# EAGLE design executingModuleTriac (EAGLE 5.07)
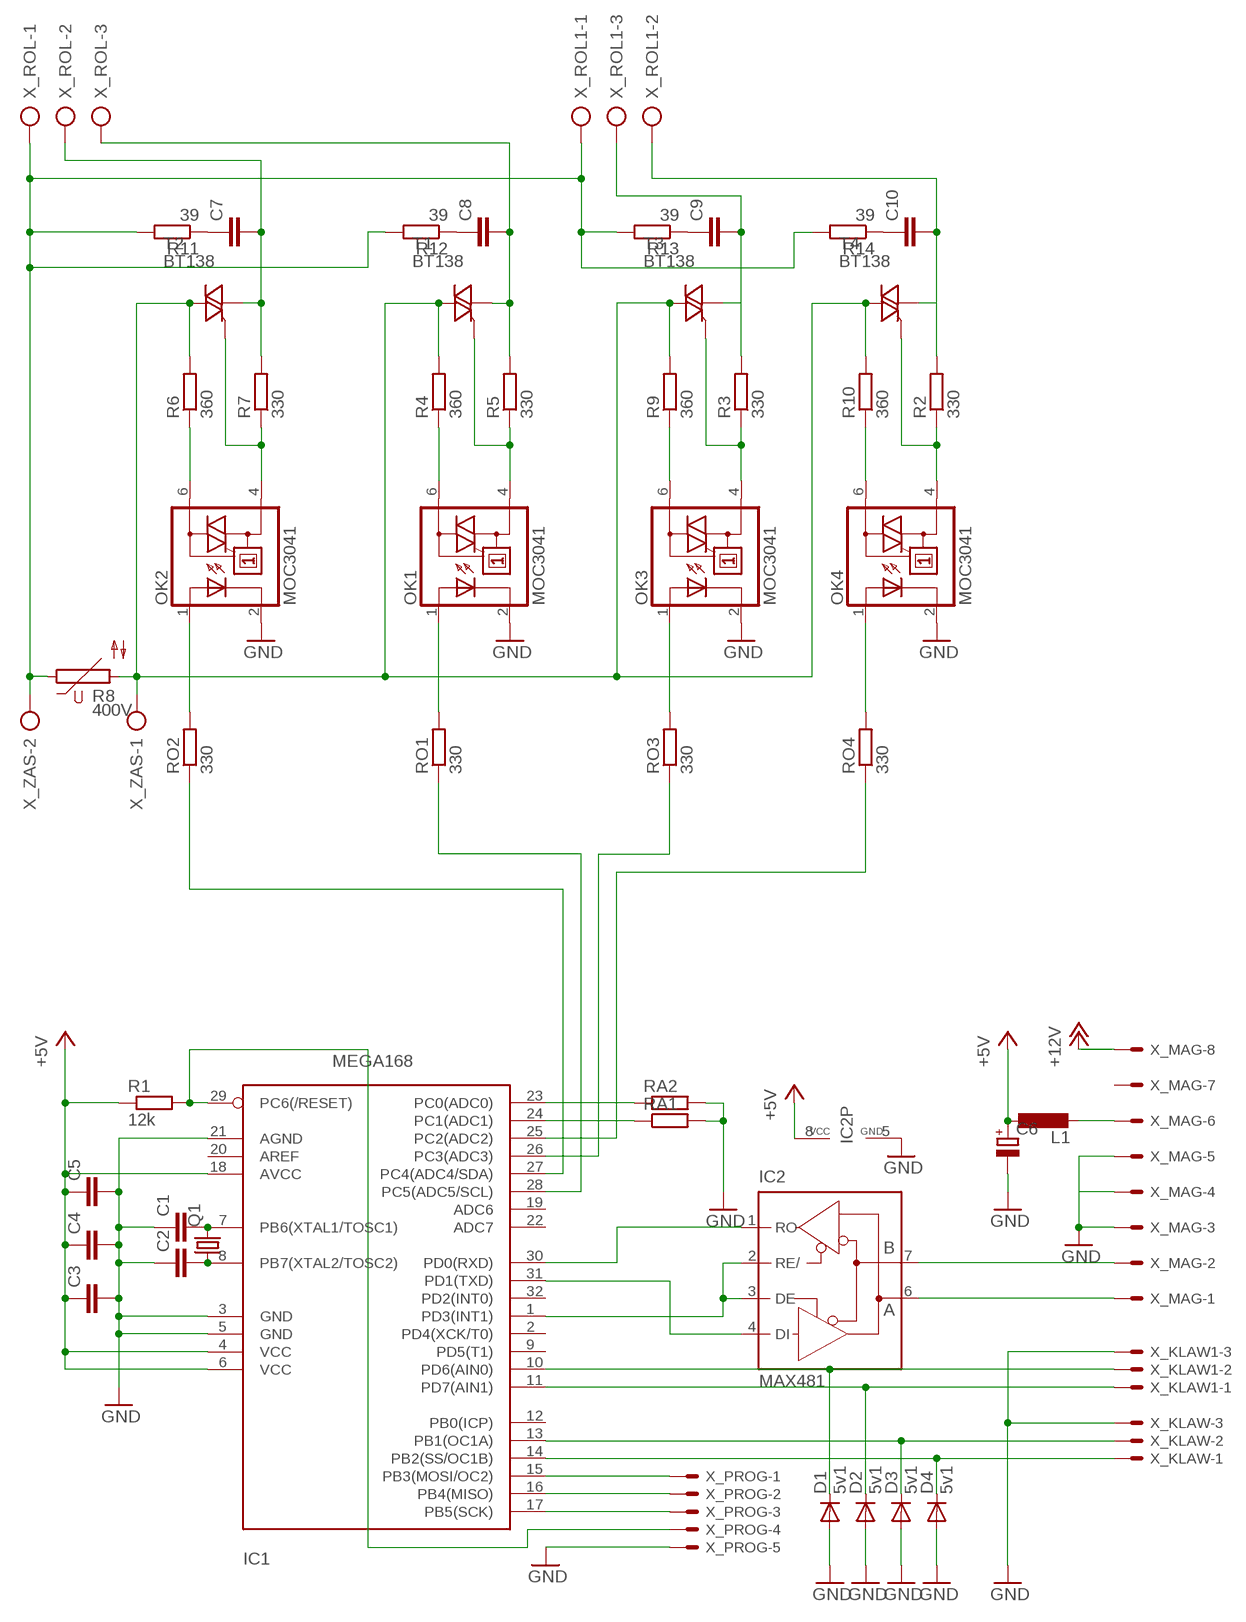
[diagram p0: schematic, sheet 1]

## Parts
C1  C-EUC0805  [C0805]
C2  C-EUC0805  [C0805]
C3  C-EUC0805  [C0805]
C4  C-EUC0805  [C0805]
C5  C-EUC0805  [C0805]
C6  CPOL-EUE2.5-6  [E2,5-6]
C7  C-EU050-025X075  [C050-025X075]
C8  C-EU050-025X075  [C050-025X075]
C9  C-EU050-025X075  [C050-025X075]
C10  C-EU050-025X075  [C050-025X075]
D1  5v1  CGRM4001-G  [SOD-123_MINI-SMA]
D2  5v1  CGRM4001-G  [SOD-123_MINI-SMA]
D3  5v1  CGRM4001-G  [SOD-123_MINI-SMA]
D4  5v1  CGRM4001-G  [SOD-123_MINI-SMA]
IC1  MEGA168  MEGA8-AI  [TQFP32-08]
IC2  MAX481  MAX481CSA  [SO08]
L1  L-EUL1812  [L1812]
OK1  MOC3041  MOC3041M  [DIL06]
OK2  MOC3041  MOC3041M  [DIL06]
OK3  MOC3041  MOC3041M  [DIL06]
OK4  MOC3041  MOC3041M  [DIL06]
Q1  CRYTALHC49S  [HC49/S]
R1  12k  R-EU_R0805  [R0805]
R2  330  R-EU_0207/2V  [0207/2V]
R3  330  R-EU_0207/2V  [0207/2V]
R4  360  R-EU_0207/2V  [0207/2V]
R5  330  R-EU_0207/2V  [0207/2V]
R6  360  R-EU_0207/2V  [0207/2V]
R7  330  R-EU_0207/2V  [0207/2V]
R8  400V  P593  [P593]
R9  360  R-EU_0207/2V  [0207/2V]
R10  360  R-EU_0207/2V  [0207/2V]
R11  39  R-EU_0207/2V  [0207/2V]
R12  39  R-EU_0207/2V  [0207/2V]
R13  39  R-EU_0207/2V  [0207/2V]
R14  39  R-EU_0207/2V  [0207/2V]
RA1  R-EU_R0805  [R0805]
RA2  R-EU_R0805  [R0805]
RO1  330  R-EU_R0805  [R0805]
RO2  330  R-EU_R0805  [R0805]
RO3  330  R-EU_R0805  [R0805]
RO4  330  R-EU_R0805  [R0805]
T1  BT138  [TO126S]
T2  BT138  [TO126S]
T3  BT138  [TO126S]
T4  BT138  [TO126S]
X_KLAW  22-23-2031  [22-23-2031]
X_KLAW1  22-23-2031  [22-23-2031]
X_MAG  22-23-2081  [22-23-2081]
X_PROG  22-23-2051  [22-23-2051]
X_ROL  COM  AK500/3-H  [AK500/3-H]
X_ROL1  COM  AK500/3-H  [AK500/3-H]
X_ZAS  AK300/2  [AK300/2]

## Nets
+5V: C3.1 C4.1 C5.1 C6.+ IC1.4(VCC) IC1.6(VCC) IC1.18(AVCC) IC2.8(VCC) L1.1 R1.1
+12V: X_MAG.8
ADDR0: IC1.23(PC0(ADC0)) RA2.1
ADDR1: IC1.24(PC1(ADC1)) RA1.1
ADDR2: IC1.15(PB3(MOSI/OC2)) X_PROG.1
ADDR3: IC1.16(PB4(MISO)) X_PROG.2
ADDR4: IC1.17(PB5(SCK)) X_PROG.3
COM: R8.1 R11.2 R12.2 R13.2 R14.2 X_ROL1.1 X_ROL.1 X_ZAS.2
F_ROL1: C7.2 R7.2 T2.C(A1) X_ROL.2
F_ROL2: C8.2 R5.2 T1.C(A1) X_ROL.3
F_ROL3: C9.2 R3.2 T3.C(A1) X_ROL1.3
F_ROL4: C10.2 R2.2 T4.C(A1) X_ROL1.2
FAZA: R4.2 R6.2 R8.2 R9.2 R10.2 T1.A(A2) T2.A(A2) T3.A(A2) T4.A(A2) X_ZAS.1
GND: C1.1 C2.1 C3.2 C4.2 C5.2 C6.- D1.A D2.A D3.A D4.A IC1.3(GND) IC1.5(GND) IC1.21(AGND) IC2.5(GND) OK1.2(C) OK2.2(C) OK3.2(C) OK4.2(C) RA1.2 RA2.2 X_KLAW1.3 X_KLAW.3 X_MAG.3 X_MAG.4 X_MAG.5 X_PROG.5
KL1: D4.C IC1.14(PB2(SS/OC1B)) X_KLAW.1
KL2: D3.C IC1.13(PB1(OC1A)) X_KLAW.2
N$1: OK2.6(A2) R6.1
N$2: L1.2 X_MAG.6
N$3: OK2.4(A1) R7.1 T2.G
N$4: IC2.7(B) X_MAG.2
N$5: IC2.6(A) X_MAG.1
N$7: OK3.4(A1) R3.1 T3.G
N$8: OK3.6(A2) R9.1
N$9: OK4.6(A2) R10.1
N$10: OK4.4(A1) R2.1 T4.G
N$12: C1.2 IC1.7(PB6(XTAL1/TOSC1)) Q1.2
N$13: C2.2 IC1.8(PB7(XTAL2/TOSC2)) Q1.1
N$17: C7.1 R11.1
N$18: D2.C IC1.11(PD7(AIN1)) X_KLAW1.1
N$19: D1.C IC1.10(PD6(AIN0)) X_KLAW1.2
N$20: C8.1 R12.1
N$22: C9.1 R13.1
N$23: C10.1 R14.1
N$24: OK1.6(A2) R4.1
N$25: OK1.4(A1) R5.1 T1.G
ROL1_ON: IC1.27(PC4(ADC4/SDA)) RO2.1
ROL1_ON_R: OK2.1(A) RO2.2
ROL2_ON: IC1.28(PC5(ADC5/SCL)) RO1.1
ROL2_ON_R: OK1.1(A) RO1.2
ROL3_ON: IC1.26(PC3(ADC3)) RO3.1
ROL3_ON_R: OK3.1(A) RO3.2
ROL4_ON: IC1.25(PC2(ADC2)) RO4.1
ROL4_ON_R: OK4.1(A) RO4.2
RST: IC1.29(PC6(/RESET)) R1.2 X_PROG.4
RXD: IC1.30(PD0(RXD)) IC2.1(RO)
TXD: IC1.31(PD1(TXD)) IC2.4(DI)
TXD_RXD_EN: IC1.1(PD3(INT1)) IC2.2(RE/) IC2.3(DE)
Unconnected: IC1.2(PD4(XCK/T0)) IC1.9(PD5(T1)) IC1.12(PB0(ICP)) IC1.19(ADC6) IC1.20(AREF) IC1.22(ADC7) IC1.32(PD2(INT0)) X_MAG.7

## Library data of the parts
C1-C5 C7-C10 = rcl:C-EU: CAPACITOR, European symbol
C6 = rcl:CPOL-EU: POLARIZED CAPACITOR, European symbol
D1-D4 = diode:CGRM400*-G: Molded plasitc,JEDEC SOD-123/Mini SMA Source: Comchip CGRM4001-G.pdf
IC1 = atmel:MEGA8: MICROCONTROLLER 8 Kbytes FLASH 1 kbytes SRAM 512 bytes EEPROM USART 6-channel 10 bit ADC 2-channel 8 bit ADC Source: avr.lbr
IC2 = maxim:MAX481CSA: RS485 TRANSEIVER
L1 = rcl:L-EU: INDUCTOR, European symbol
OK1-OK4 = optocoupler:MOC30*: 6-Pin DIP Zero-Cross Optoisolators Triac Driver Output (250/400 Volt Peak) Source: http://www.fairchildsemi.com/ds/MO/MOC3043-M.pdf
Q1 = crystal:CRYTAL: CRYSTAL
R1-R7 R9-R14 RA1 RA2 RO1-RO4 = rcl:R-EU_: RESISTOR, European symbol
R8 = varistor:P593: VARISTOR
T1-T4 = triac:BT138: TRIAC Source: http://www.semiconductors.philips.com BT138_SERIES_2.pdf
X_KLAW X_KLAW1 = con-molex:22-23-2031: .100" (2.54mm) Center Header - 3 Pin
X_MAG = con-molex:22-23-2081: .100" (2.54mm) Center Header - 8 Pin
X_PROG = con-molex:22-23-2051: .100" (2.54mm) Center Header - 5 Pin
X_ROL X_ROL1 = con-ptr500:AK500/3-H: CONNECTOR Aug. 2004 / PTR Meßtechnik: Die Bezeichnung der Serie AK505 wurde geändert. Es handelt sich hierbei um AK500 in horizontaler Ausführung.
X_ZAS = con-ptr500:AK300/2: CONNECTOR

## Board
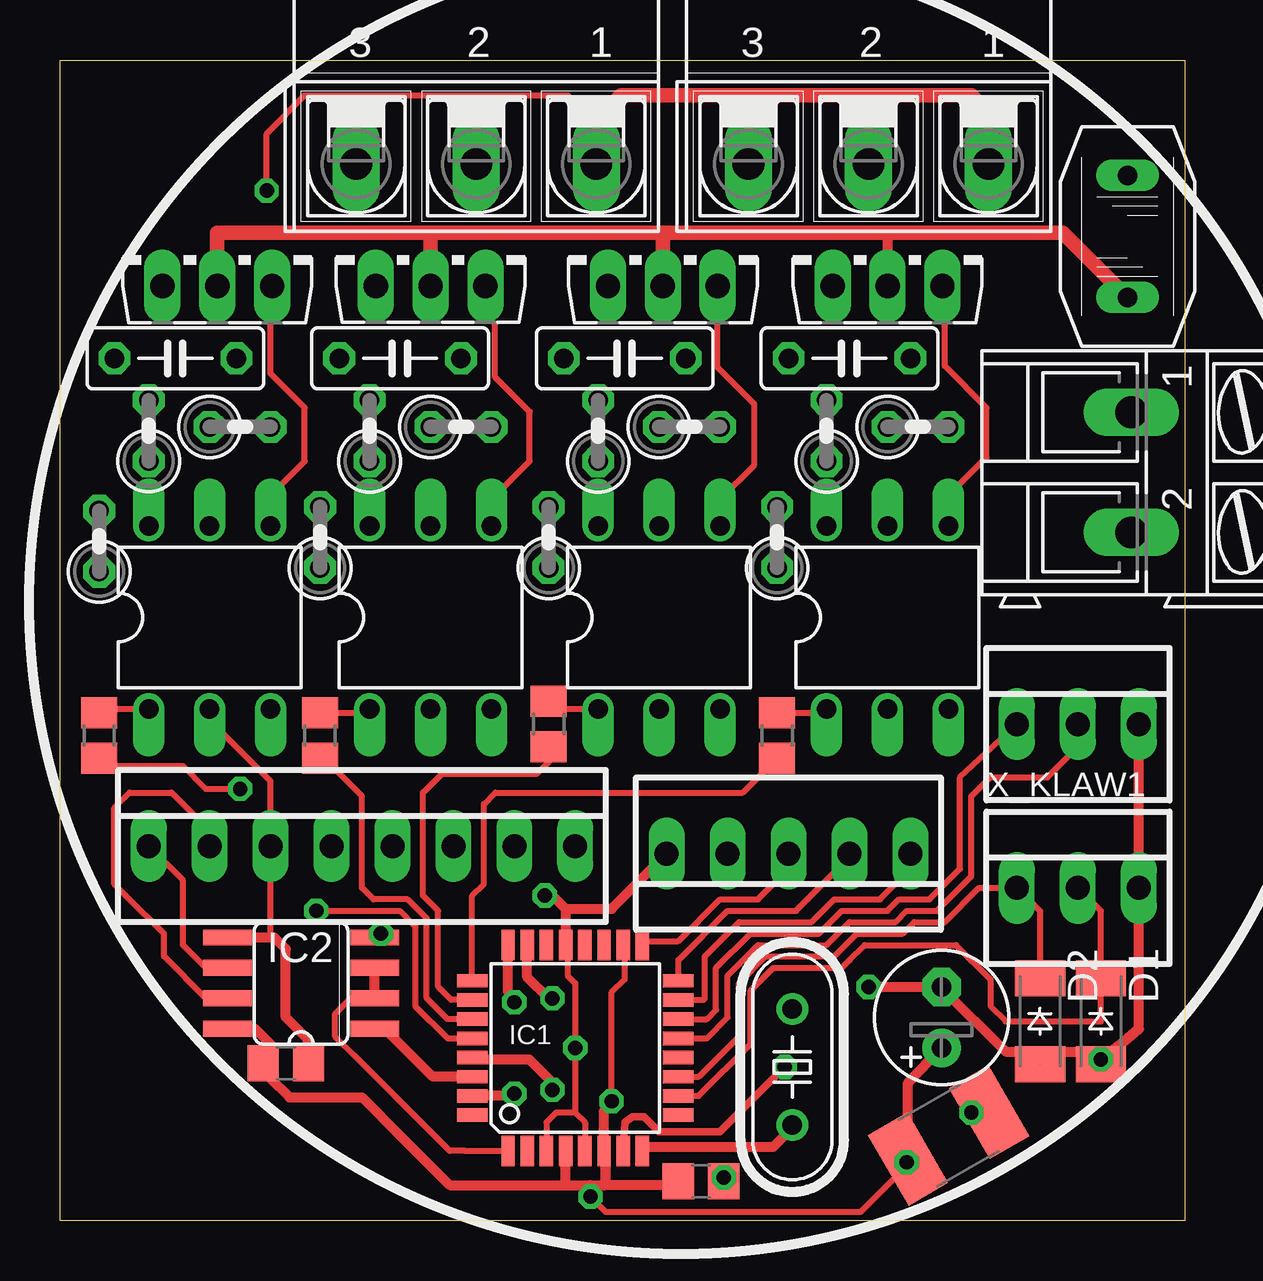
[diagram p1: board, top side]
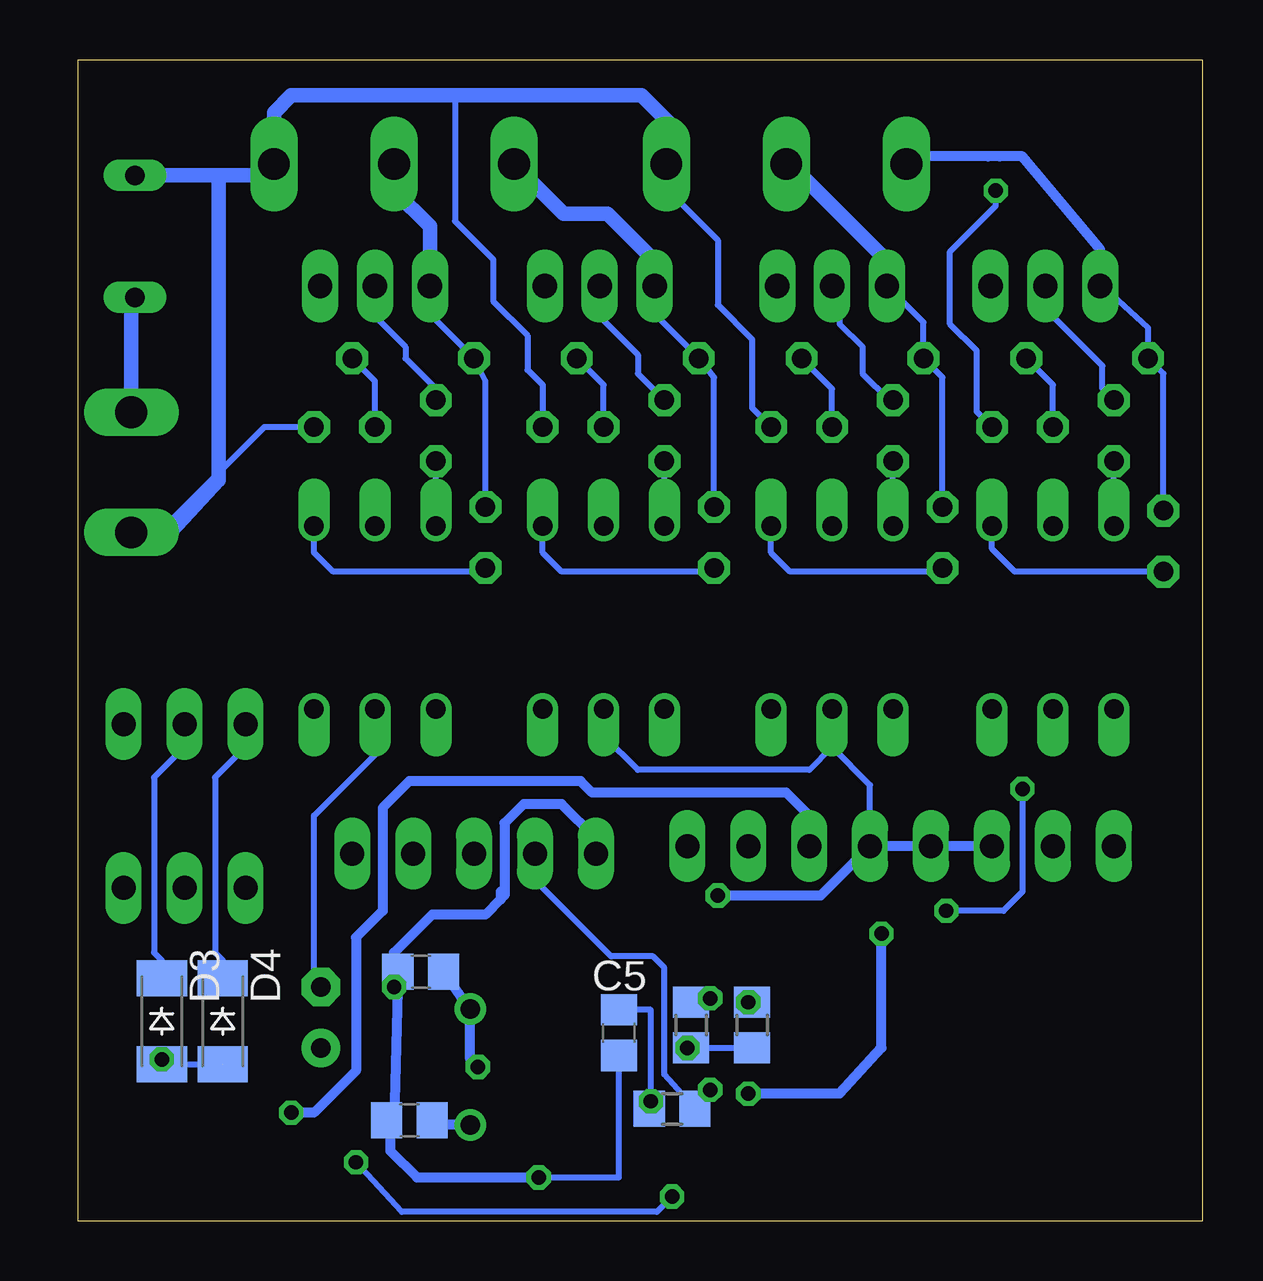
[diagram p2: board, bottom side, seen from below]

Size 46.88 x 48.36 mm. Coordinates in mm from the lower left corner, seen from the top.
Outline: 0,48.35 46.88,48.35 46.88,0 0,0 0,48.35
Copper layers (1*16): Top 0.035mm / dielectric 1.5mm / Bottom 0.035mm
Design rules "default *": minimum track width 10mil, minimum drill 20mil, track to track 8mil, track to pad 8mil, pad to pad 8mil, via to via 8mil, smd to smd 8mil, copper to edge 5mil, drill to drill 8mil, minimum pad ring 10mil, minimum via ring 8mil, stop-mask expansion 4mil, vias tented up to drill 0mil, thermal gap 10mil

### Footprints (pad centres in the part's own frame; a part is rotated, then mirrored left to right if it is on the bottom)
C0805 = smd 1.3 x 1.5: 1 -0.95,0; 2 0.95,0
E2,5-6 = drill 0.813 pad 1.6 round: + -1.27,0 | drill 0.813 pad 1.6 octagon: - 1.27,0
C050-025X075 = drill 0.813 octagon: 1 -2.54,0; 2 2.54,0
SOD-123_MINI-SMA = smd 1.5 x 2.1: A 1.8,0; C -1.8,0
TQFP32-08 = smd 1.27 x 0.559: 1 -4.293,2.8; 2 -4.293,2; 3 -4.293,1.2; 4 -4.293,0.4; 5 -4.293,-0.4; 6 -4.293,-1.2; 7 -4.293,-2; 8 -4.293,-2.8; 17 4.293,-2.8; 18 4.293,-2; 19 4.293,-1.2; 20 4.293,-0.4; 21 4.293,0.4; 22 4.293,1.2; 23 4.293,2; 24 4.293,2.8 | smd 0.559 x 1.27: 9 -2.8,-4.293; 10 -2,-4.293; 11 -1.2,-4.293; 12 -0.4,-4.293; 13 0.4,-4.293; 14 1.2,-4.293; 15 2,-4.293; 16 2.8,-4.293; 25 2.8,4.293; 26 2,4.293; 27 1.2,4.293; 28 0.4,4.293; 29 -0.4,4.293; 30 -1.2,4.293; 31 -2,4.293; 32 -2.8,4.293
SO08 = smd 0.66 x 2.032: 1 -1.905,-3.073; 2 -0.635,-3.073; 3 0.635,-3.073; 4 1.905,-3.073; 5 1.905,3.073; 6 0.635,3.073; 7 -0.635,3.073; 8 -1.905,3.073
L1812 = smd 1.9 x 3.4: 1 -1.95,0; 2 1.95,0
DIL06 = drill 0.813 offset: 1 -2.54,-3.81; 2 0,-3.81; 3 2.54,-3.81; 4 2.54,3.81; 5 0,3.81; 6 -2.54,3.81
HC49/S = drill 0.813 round: 1 -2.413,0; 2 2.413,0
R0805 = smd 1.3 x 1.5: 1 -0.95,0; 2 0.95,0
0207/2V = drill 0.813 octagon: 1 -1.27,0; 2 1.27,0
P593 = drill 0.813 long: 1 0,2.54; 2 0,-2.54
TO126S = drill 1.016 long: A 0,-1.27; C -2.286,-1.27; G 2.286,-1.27
22-23-2031 = drill 1 long: 1 -2.54,0; 2 0,0; 3 2.54,0
22-23-2081 = drill 1 long: 1 -8.89,0; 2 -6.35,0; 3 -3.81,0; 4 -1.27,0; 5 1.27,0; 6 3.81,0; 7 6.35,0; 8 8.89,0
22-23-2051 = drill 1 long: 1 -5.08,0; 2 -2.54,0; 3 0,0; 4 2.54,0; 5 5.08,0
AK500/3-H = drill 1.321 long: 1 -5.004,0; 2 0,0; 3 5.004,0
AK300/2 = drill 1.321 long: 1 -2.515,0; 2 2.489,0

### Placement (x,y rotation side)
C1  32.59,10.37 0 bottom
C2  33.07,4.17 0 bottom
C3  9.41,6.56 0 top
C4  26.72,1.64 0 top
C5  24.34,7.83 270 bottom
C6  36.75,8.46 90 top
C7  14.18,35.92 180 top
C8  4.81,35.92 180 top
C9  23.54,35.92 180 top
C10  32.91,35.92 180 top
D1  43.39,8.3 270 top
D2  40.85,8.3 270 top
D3  43.39,8.3 270 bottom
D4  40.85,8.3 270 bottom
IC1  21.48,7.19 90 top
IC2  10.05,9.89 90 top
L1  37.04,3.54 30 top
OK1  6.24,25.13 0 top
OK2  15.45,25.13 0 top
OK3  24.97,25.13 0 top
OK4  34.5,25.13 0 top
Q1  30.53,6.4 90 top
R1  22.11,4.65 0 bottom
R2  29.89,28.46 90 top
R3  20.37,28.46 90 top
R4  3.7,32.91 90 top
R5  1.63,28.31 90 top
R6  12.91,32.91 90 top
R7  10.84,28.46 90 top
R8  44.5,41.01 0 top
R9  22.43,32.91 90 top
R10  31.96,32.91 90 top
R11  16.72,33.07 0 top
R12  7.51,33.07 0 top
R13  26.24,33.07 0 top
R14  35.77,33.07 0 top
RA1  18.78,8.14 270 bottom
RA2  21.32,8.14 270 bottom
RO1  1.64,20.21 90 top
RO2  10.84,20.21 90 top
RO3  20.37,20.68 90 top
RO4  29.89,20.21 90 top
T1  6.56,40.21 0 top
T2  15.45,40.21 0 top
T3  25.13,40.21 0 top
T4  34.5,40.21 0 top
X_KLAW  42.43,20.68 0 top
X_KLAW1  42.43,13.86 0 top
X_MAG  12.59,15.61 0 top
X_PROG  30.37,15.29 180 top
X_ROL  17.35,44.02 180 top
X_ROL1  33.7,44.02 180 top
X_ZAS  44.66,31.16 270 top

### Tracks (layer width: path | path; a pad name or v marks a point on that pad's centre or on a via)
+5V  (via drill 0.6)
  Top 0.254: v23,4.97 23,9.5 23.54,10.05 23.54,11.42 IC1.18 | 25.45,1.48 22.11,1.48 v22.11,1 22.75,0.36 33.39,0.36 35.59,2.56 | 35.59,2.56 L1.1 | v35.29,2.43 35.59,2.56
  Top 0.406: C3.1 8.72,6.56 | 8.72,6.56 8.78,6.56 8.78,7.35 8.14,7.98 IC2.8 | 8.72,6.56 8.72,5.98 9.57,5.13 12.59,5.13 14.18,3.54 16.24,1.48 21,1.48 | 21,1.48 22.11,1.48 22.75,1.48 22.75,2.27 | 22.75,2.27 22.75,2.35 IC1.6 22.68,4.58 22.91,4.81 v23,4.97 | IC1.4 21.08,1.56 21,1.48 | C4.1 25.45,1.48 25.29,1.48 22.75,1.48 22.75,2.27 | L1.1 35.35,5.73 C6.+
  Bottom 0.254: R1.1 23,4.65 v23,4.97 23,8.78 C5.1 | v22.11,1 22.75,0.36 33.39,0.36 v35.29,2.43
ADDR0  (via drill 0.6)
  Top 0.406: IC1.23 19.48,10.14 20.37,9.25 v20.53,9.25
  Bottom 0.406: v20.53,9.25 20.53,9.41 20.21,9.41 RA2.1
ADDR1  (via drill 0.6)
  Top 0.406: IC1.24 18.68,9.51 v18.94,9.09
  Bottom 0.254: RA1.1 v18.94,9.09
ADDR2
  Top 0.254: IC1.15 26.81,9.19 26.88,9.25 26.88,11 28.31,12.43 31.32,12.43 32.27,13.38 34.18,13.38 35.45,14.65
  Top 0.305: 35.45,14.65 X_PROG.1
ADDR3
  Top 0.254: IC1.16 25.77,10.85 27.83,12.91 30.69,12.91 31.16,13.38 32.91,15.13
  Top 0.305: 32.91,15.13 X_PROG.2
ADDR4
  Top 0.254: 30.37,14.65 29.1,13.38 27.51,13.38 25.77,11.64 24.34,11.64 24.34,11.55 IC1.17
  Top 0.305: 30.37,14.65 X_PROG.3
COM  (via drill 0.6)
  Top 0.254: v8.62,42.91 8.62,45.29 10.21,46.88 21.16,46.88 22.27,45.77 | 22.27,44.18 22.27,44.1 X_ROL.1 | R12.2
  Top 0.61: 38.78,44.02 38.78,46.08 37.99,46.88 23.38,46.88 22.27,45.77 22.27,44.18
  Bottom 0.254: 22.27,45.77 22.27,44.1 X_ROL.1 22.27,43.94 22.27,42.91 20.21,40.85 20.21,38.15 18.78,36.72 18.78,33.86 R11.2 | R12.2 9.41,33.7 9.41,36.24 10.53,37.35 10.53,40.37 8.62,42.27 v8.62,42.91 | R14.2 39.1,33.07 43.55,28.62 44.66,28.62 44.82,28.78 42.99,28.7 | R13.2 27.51,34.81 28.15,35.45 28.15,36.88 29.58,38.31 29.58,40.05 31.16,41.64 31.16,46.88
  Bottom 0.406: 45.02,28.67 X_ZAS.2
  Bottom 0.61: 45.02,28.67 42.99,28.7 41.01,30.84 41.01,43.55 R8.1 39.18,43.54 X_ROL1.1 38.71,46.16 37.99,46.88 31.16,46.88 23.38,46.88 22.27,45.77
F_ROL1
  Bottom 0.254: T2.C 11.64,37.42 C7.2 10.84,35.13 R7.2 | 15.29,42.12
  Bottom 0.61: T2.C 13.16,39.99 15.29,42.12 16.72,43.54 16.88,43.54 X_ROL.2
F_ROL2
  Bottom 0.254: 4.27,39.04 2.27,37.19 C8.2 | R5.2 1.64,35.29 C8.2 | C8.2
  Bottom 0.406: T1.C 4.27,39.04 4.27,40.47 7.51,44.34 8.46,44.34 8.94,44.34 12.11,44.34 12.35,44.1 X_ROL.3
F_ROL3
  Bottom 0.254: R3.2 20.37,35.13 C9.2 | C9.2 | C9.2 22.75,37.67 22.75,38.85 T3.C
  Bottom 0.61: T3.C 22.84,39.99 24.81,41.96 26.64,41.96 X_ROL1.3
F_ROL4
  Bottom 0.254: R2.2 29.89,34.97 C10.2 | C10.2 | C10.2 32.27,37.83 32.27,38.88 T4.C
  Bottom 0.61: T4.C 32.21,41.42 33.7,42.91 X_ROL1.2
FAZA
  Top 0.254: 24.81,41.16 25.13,41.16 | 6.56,41.16 6.72,41.16 | 34.5,41.16
  Top 0.406: 34.5,41.16 T4.A
  Top 0.61: 15.45,41.16 T2.A | 6.72,41.16 15.45,41.16 | 15.45,41.16 24.81,41.16 34.5,41.16 41.8,41.16 R8.2 | 25.13,41.16 T3.A | T1.A 6.56,41.16
  Bottom 0.254: R4.2 4.18,34.65 4.18,35.61 6.56,37.99 T1.A | R6.2 13.07,34.18 14.18,35.29 14.18,36.4 15.13,37.35 15.13,38.62 T2.A | T1.A | R9.2 | R9.2 23.54,35.29 23.54,36.08 25.13,37.67 T3.A | T3.A | R10.2 31.96,34.65 33.23,35.92 33.23,36.4 34.5,37.67 T4.A | T4.A
  Bottom 0.406: R8.2 44.66,38.31
  Bottom 0.61: 44.66,38.31 X_ZAS.1
GND  (via drill 0.6)  (1 unrouted)
  Top 0.254: IC1.5 21.88,4.09 21.48,4.49 | IC1.3 20.28,4.09 20.69,4.49 21.48,4.49 | 21.48,4.49 | 21.48,4.49 v21.48,7.19 21.48,9.89 21.16,10.21 21.16,11.4 IC1.21 | 21.48,4.49 | 7.67,19.41 8.78,18.3 X_MAG.3 8.78,11.79 | 7.67,19.41 | 7.67,19.41 6.24,20.84 OK1.2 | 40.85,7.03 D4.A | D3.A | 43.39,7.03 D3.A | v43.39,6.71 43.96,7.19 44.52,7.59
  Top 0.406: 8.78,11.79 IC2.5 7.3,11.79 8.94,11.79 9.41,11.32 9.41,8.46 10.34,7.54 C3.2 | 21.08,12.99 IC1.21 | 21.08,12.99 20.53,13.54 v20.21,13.54 | 21.08,12.99 22.99,12.99 X_PROG.5 | v27.67,1.79 27.51,1.63 C4.2 | v33.7,9.73 C6.- 36.75,9.7 39.42,7.03 40.85,7.03 43.39,7.03 v43.39,6.71 44.52,7.59 44.97,7.98 X_KLAW1.3 X_KLAW.3 | X_KLAW.3
  Bottom 0.254: 24.34,5.92 24.34,1.79 v27.67,1.79 | 24.34,5.92 C5.2 | 24.34,5.92 | RA2.2 RA1.2 | RA2.2 | RA2.2 v21.48,7.19 | 15.45,19.73 OK2.2 | OK4.2 34.5,19.41 37.04,16.87 37.04,10.02 C6.- | D4.A D3.A 42.91,6.24 v43.39,6.71 | OK3.2 24.97,20.21 23.54,18.78 16.4,18.78 15.45,19.73 | X_MAG.5 13.86,18.14 15.45,19.73
  Bottom 0.406: v27.67,1.79 32.75,1.79 33.86,2.9 33.86,4.17 C2.1 33.7,4.17 C1.1 33.54,9.89 v33.7,9.73 33.7,10.37 33.7,11.16 32.12,12.75 29.89,12.75 29.26,13.38 29.26,13.7 29.1,13.54 29.1,16.56 28.31,17.35 26.72,17.35 25.29,15.92 X_PROG.5 | v20.21,13.54 15.92,13.54 X_MAG.5 X_MAG.4 X_MAG.3
KL1
  Top 0.254: IC1.14 26.97,8.39 27.35,8.78 27.35,10.52 28.78,11.95 31.64,11.95 31.96,12.27 | 31.96,12.27 | 31.96,12.27 32.59,12.91 34.5,12.91 34.97,13.38 36.24,13.38 37.51,14.65 37.51,18.46 39.74,20.53 X_KLAW.1
  Top 0.305: 39.74,20.53 39.26,20.05
  Bottom 0.254: D4.C 40.85,10.84 41.16,11.16 41.16,18.46 39.89,19.73 X_KLAW.1
KL2
  Top 0.254: IC1.13 26.96,7.59 27.83,8.46 27.83,10.21 29.1,11.48 31.96,11.48 32.91,12.43 34.81,12.43 35.29,12.91 36.56,12.91 37.99,14.33 37.99,17.67 38.78,18.46 41.16,18.46 42.43,19.73 X_KLAW.2 | X_KLAW.2
  Bottom 0.254: D3.C 43.39,10.84 43.7,11.16 43.7,18.46 42.43,19.73 X_KLAW.2 | X_KLAW.2
N$1
  Bottom 0.254: OK2.6 12.91,31.48
  Bottom 0.406: 12.91,31.48 R6.1
N$2  (via drill 0.6)
  Top 0.406: v37.99,4.49 38.7,4.49 L1.2
  Bottom 0.406: X_MAG.6 16.4,16.87 17.35,17.83 25.45,17.83 25.92,18.3 33.07,18.3 34.18,17.19 34.18,12.91 35.29,11.79 35.29,6.24 37.04,4.49 v37.99,4.49
N$3
  Top 0.254: OK2.4 17.99,30.05 19.57,31.64 19.57,33.7 18.15,35.13 18.15,37.35 17.67,37.83 17.67,38.88 T2.G
  Bottom 0.254: OK2.4 17.99,27.83 17.19,27.03 11,27.03 R7.1
N$4
  Top 0.254: IC2.7 6.08,9.25 4.33,11 4.33,11.95 2.75,13.54 2.27,14.02 2.27,17.19 2.91,17.83 4.65,17.83 6.24,16.24 X_MAG.2
N$5
  Top 0.254: IC2.6 6.08,10.52 5.13,11.48 5.13,14.18 X_MAG.1
N$7
  Top 0.254: T3.G 27.42,35.54 28.94,34.02 28.94,31.48 27.51,30.05 27.51,28.78 OK3.4
  Bottom 0.254: R3.1 20.53,27.03 26.72,27.03 27.51,27.83 27.51,28.78 OK3.4
N$8
  Bottom 0.254: OK3.6 R9.1 | R9.1
N$9
  Bottom 0.254: OK4.6 R10.1 | R10.1
N$10
  Top 0.254: OK4.4 37.04,30.21 38.62,31.8 38.62,33.86 36.88,35.61 36.88,38.85 T4.G
  Bottom 0.254: R2.1 30.05,27.03 36.24,27.03 37.04,27.83 OK4.4
N$12  (via drill 0.6)
  Top 0.305: IC1.7 23.54,4.1 23.86,4.33 24.34,4.33 24.97,3.7 27.51,3.7 v30.21,6.4
  Bottom 0.406: 30.53,6.71 Q1.2 30.56,8.81 C1.2 | 30.53,6.71 | v30.21,6.4 30.53,6.71
N$13
  Top 0.406: IC1.8 24.44,3.06 29.73,3.06 30.53,3.86 Q1.1
  Bottom 0.406: C2.2 32.09,3.98 Q1.1
N$17
  Bottom 0.254: R11.1 15.45,34.65 C7.1
N$18
  Top 0.254: IC1.11 26.63,5.99 28.31,7.67 28.31,9.89 29.42,11 32.27,11 33.23,11.95 35.13,11.95 35.61,12.43 36.88,12.43 38.31,13.86 X_KLAW1.1 40.85,12.91 D2.C
N$19
  Top 0.254: IC1.10 26.62,5.19 28.78,7.35 28.78,9.57 29.73,10.52 32.59,10.52 32.91,10.84 | 32.91,10.84 | 32.91,10.84 33.54,11.48 37.35,11.48 38.78,10.05 38.78,8.94 39.42,8.3 43.39,8.3 D1.C | D1.C 43.39,12.91 X_KLAW1.2 | D1.C
N$20
  Bottom 0.254: R12.1 6.24,34.81 C8.1
N$22
  Bottom 0.254: R13.1 24.97,34.81 C9.1
N$23
  Bottom 0.254: R14.1 34.5,34.97 C10.1
N$24
  Bottom 0.254: OK1.6 R4.1
  Bottom 0.406: R4.1
N$25
  Top 0.254: T1.G 8.78,38.88 8.78,35.29 10.21,33.86 10.21,31.64 8.78,30.21 OK1.4
  Bottom 0.254: R5.1 7.83,27.03 8.78,27.99 OK1.4
  Bottom 0.406: OK1.4
ROL1_ON
  Top 0.254: IC1.27 16.15,8.39 15.29,9.25 15.29,12.59 14.49,13.38 13.07,13.38 12.59,13.86 12.59,17.67 11,19.26 11,19.58 RO2.1
ROL1_ON_R
  Top 0.254: RO2.2 12.75,21.16 OK2.1
ROL2_ON  (via drill 0.6)
  Top 0.254: IC1.28 16.16,7.59 14.81,8.94 14.81,12.27 14.18,12.91 v10.68,12.91 | v7.51,17.99 6.08,17.99 5.13,18.94 1.96,18.94 RO1.1
  Bottom 0.254: v10.68,12.91 8.3,12.91 7.51,13.7 v7.51,17.99
ROL2_ON_R
  Top 0.254: OK1.1 | OK1.1 1.8,21.32 RO1.2
ROL3_ON
  Top 0.254: IC1.26 16.3,9.19 15.76,9.73 15.76,12.91 15.13,13.54 15.13,17.83 15.92,18.62 19.89,18.62 20.37,19.1 RO3.1 | RO3.1
ROL3_ON_R
  Top 0.254: OK3.1 20.68,21.32 RO3.2
ROL4_ON
  Top 0.254: IC1.25 17.19,13.53 17.67,14.02 17.67,17.35 18.15,17.83 28.46,17.83 RO4.1
ROL4_ON_R
  Top 0.254: RO4.2 31.8,21.16 OK4.1
RST  (via drill 0.6)
  Top 0.406: IC1.29 17.41,6.72 19.56,6.72 20.52,5.76 20.53,5.6 v20.53,5.44
  Bottom 0.254: X_PROG.4 27.83,14.18 24.65,11 22.91,11 22.43,10.52 22.43,6.08 R1.2
  Bottom 0.406: v20.53,5.44 R1.2
RXD
  Top 0.406: IC2.1 13.6,7.93 15.54,5.99 IC1.30
TXD  (via drill 0.6)
  Top 0.406: IC1.31 18.84,5.19 v18.94,5.29 | v13.38,11.95 13.6,11.95 IC2.4
  Bottom 0.406: v18.94,5.29 15.13,5.29 13.38,7.19 v13.38,11.95
TXD_RXD_EN
  Top 0.254: IC2.2 12.11,9.25 11.48,8.62 11.48,7.67 12.27,6.87 12.75,6.4 16.24,2.9 16.88,2.9 17.57,2.9 IC1.1
  Top 0.406: IC2.2 IC2.3